# Altium schematic sheet FOTA MicroController.SchDoc: FOTA MicroController
size A4; SheetNumber: 21; SheetTotal: 37
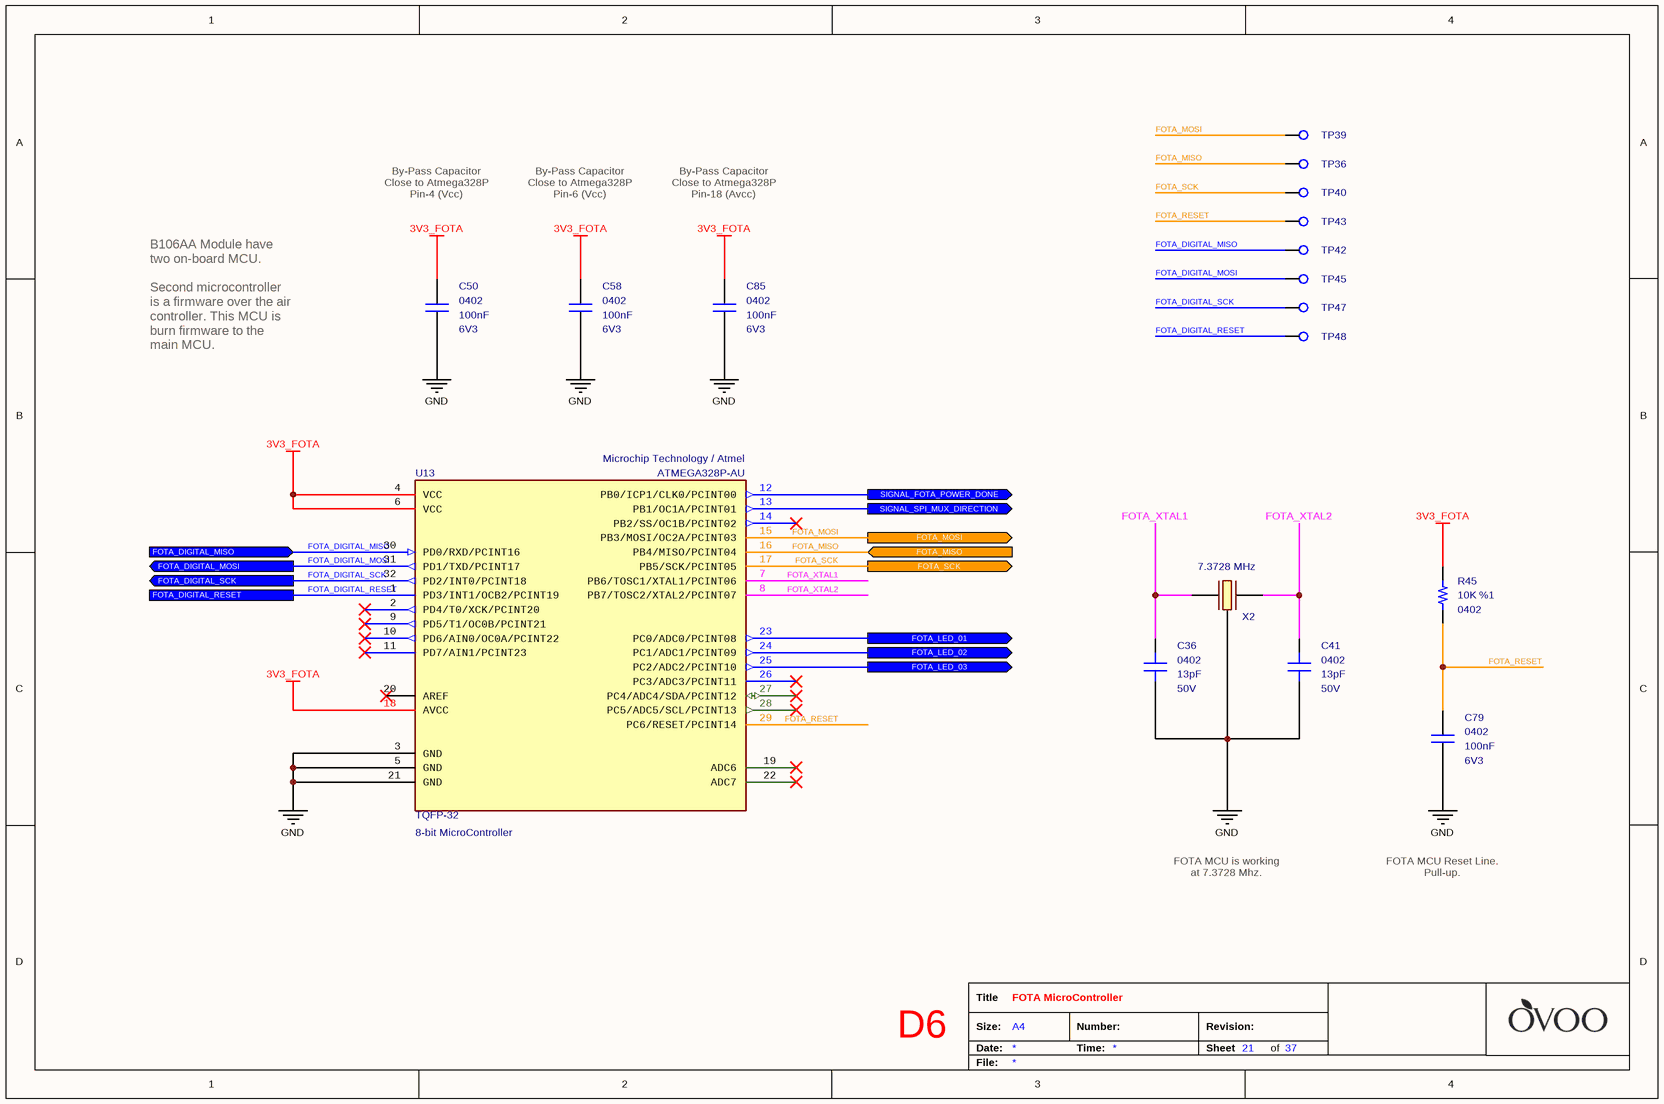
[diagram p0: FOTA MicroController.SchDoc]

## Parts
C36  value 13pF  Voltage: 50V  Case: 0402  [CAPACITOR_0402]  (hidden comment: Multilayer Ceramic Capacitors)
C41  value 13pF  Voltage: 50V  Case: 0402  [CAPACITOR_0402]  (hidden comment: Multilayer Ceramic Capacitors)
C50  value 100nF  Case: 0402  Voltage: 6V3  [CAPACITOR_0402]  (hidden comment: Multilayer Ceramic Capacitor)
C58  value 100nF  Case: 0402  Voltage: 6V3  [CAPACITOR_0402]  (hidden comment: Multilayer Ceramic Capacitor)
C79  value 100nF  Case: 0402  Voltage: 6V3  [CAPACITOR_0402]  (hidden comment: Multilayer Ceramic Capacitor)
C85  value 100nF  Case: 0402  Voltage: 6V3  [CAPACITOR_0402]  (hidden comment: Multilayer Ceramic Capacitor)
R45  value 10K  Tolerance: %1  Case: 0402  [RESISTOR_0402]  (hidden comment: Thick Film Resistor)
TP36  PCB - Test Point  [Test_Pad - Hole]  (value not drawn)  (no BOM)
TP39  PCB - Test Point  [Test_Pad - Hole]  (value not drawn)  (no BOM)
TP40  PCB - Test Point  [Test_Pad - Hole]  (value not drawn)  (no BOM)
TP42  PCB - Test Point  [Test_Pad - Hole]  (value not drawn)  (no BOM)
TP43  PCB - Test Point  [Test_Pad - Hole]  (value not drawn)  (no BOM)
TP45  PCB - Test Point  [Test_Pad - Hole]  (value not drawn)  (no BOM)
TP47  PCB - Test Point  [Test_Pad - Hole]  (value not drawn)  (no BOM)
TP48  PCB - Test Point  [Test_Pad - Hole]  (value not drawn)  (no BOM)
U13  8-bit MicroController  Manufacturer_Part_Number: ATMEGA328P-AU  Manufacturer_Name: Microchip Technology / Atmel  Case: TQFP-32  [TQFP32]
X2  7.3728 MHz  [ABRACON_CRYSTAL]

## Ports
FOTA_DIGITAL_MISO (in), FOTA_DIGITAL_MOSI (out), FOTA_DIGITAL_RESET, FOTA_DIGITAL_SCK (out), FOTA_LED_01 (out), FOTA_LED_02 (out), FOTA_LED_03 (out), FOTA_MISO (in), FOTA_MOSI (out), FOTA_SCK (out), SIGNAL_FOTA_POWER_DONE (out), SIGNAL_SPI_MUX_DIRECTION (out)

## Nets
3V3_FOTA: C50.2 C58.2 C85.2 R45.2 U13.4(VCC) U13.6(VCC) U13.18(AVCC)
GND: C36.1 C41.1 C50.1 C58.1 C79.1 C85.1 U13.3(GND) U13.5(GND) U13.21(GND) X2.2(GND)
FOTA_DIGITAL_MISO: TP42.1 U13.30(PD0/RXD/PCINT16) ; port FOTA_DIGITAL_MISO
FOTA_DIGITAL_MOSI: TP45.1 U13.31(PD1/TXD/PCINT17) ; port FOTA_DIGITAL_MOSI
FOTA_DIGITAL_RESET: TP48.1 U13.1(PD3/INT1/OCB2/PCINT19) ; port FOTA_DIGITAL_RESET
FOTA_DIGITAL_SCK: TP47.1 U13.32(PD2/INT0/PCINT18) ; port FOTA_DIGITAL_SCK
FOTA_LED_01: U13.23(PC0/ADC0/PCINT08) ; port FOTA_LED_01
FOTA_LED_02: U13.24(PC1/ADC1/PCINT09) ; port FOTA_LED_02
FOTA_LED_03: U13.25(PC2/ADC2/PCINT10) ; port FOTA_LED_03
FOTA_MISO: TP36.1 U13.16(PB4/MISO/PCINT04) ; port FOTA_MISO
FOTA_MOSI: TP39.1 U13.15(PB3/MOSI/OC2A/PCINT03) ; port FOTA_MOSI
FOTA_RESET: C79.2 R45.1 TP43.1 U13.29(PC6/RESET/PCINT14)
FOTA_SCK: TP40.1 U13.17(PB5/SCK/PCINT05) ; port FOTA_SCK
FOTA_XTAL1: C36.2 U13.7(PB6/TOSC1/XTAL1/PCINT06) X2.3(OUT/IN)
FOTA_XTAL2: C41.2 U13.8(PB7/TOSC2/XTAL2/PCINT07) X2.1(IN/OUT)
SIGNAL_FOTA_POWER_DONE: U13.12(PB0/ICP1/CLK0/PCINT00) ; port SIGNAL_FOTA_POWER_DONE
SIGNAL_SPI_MUX_DIRECTION: U13.13(PB1/OC1A/PCINT01) ; port SIGNAL_SPI_MUX_DIRECTION

Not connected (* = marked no-connect by the designer): U13 2(PD4/T0/XCK/PCINT20)* 9(PD5/T1/OC0B/PCINT21)* 10(PD6/AIN0/OC0A/PCINT22)* 11(PD7/AIN1/PCINT23)* 14(PB2/SS/OC1B/PCINT02)* 19(ADC6)* 20(AREF)* 22(ADC7)* 26(PC3/ADC3/PCINT11)* 27(PC4/ADC4/SDA/PCINT12)* 28(PC5/ADC5/SCL/PCINT13)*; X2 4(GND)

## Notes on the sheet
- By-Pass Capacitor
  Close to Atmega328P
  Pin-4 (Vcc)
- By-Pass Capacitor
  Close to Atmega328P
  Pin-6 (Vcc)
- By-Pass Capacitor
  Close to Atmega328P
  Pin-18 (Avcc)
- B106AA Module have two on-board MCU.
  Second microcontroller is a firmware over the air controller. This MCU is burn firmware to the main MCU.
- FOTA MCU is working at 7.3728 Mhz.
- FOTA MCU Reset Line. Pull-up.
- D6
- Title
- Size:
- Date:
- A4
- Number:
- Time:
- Revision:
- Sheet
- of
- File:

## Library data of the parts
C36 C41 = Capacitor - 13pF [0402-50V): Capacitor - 13pF [0402] (Ceramic); Manufacturer_Name: Kemet; Manufacturer_Part_Number: CBR04C130F5GAC; Dielectric: C0G; Tolerance: 1%; Height: 0.55mm; Mouser_Part_Number: 80-CBR04C130F5GAC; ROHS: Yes; Weight: 0.65mg; ComponentLink1Description: DataSheet; ComponentLink1URL: http://www.kemet.com/Lists/ProductCatalog/Attachments/490/KEM_C1030_CBR_SMD.pdf; ComponentLink2Description: Mouser; ComponentLink2URL: http://www.mouser.com/Search/ProductDetail.aspx?qs=kSX8PZDGYstn%252bRHasf81FA%3d%3d; Supplier 1: Mouser; Supplier 2: Farnell; Supplier 3: Digi-Key; Supplier Part Number 3: 399-8812-1-ND; Supplier Part Number 2: 2773390; Supplier Part Number 1: 80-CBR04C130F5GAC
C50 C58 C79 C85 = Capacitor - 100nF [0402-6V3]: Capacitor - 100nF [0402-6V3] (Ceramic); Manufacturer_Name: AVX; Manufacturer_Part_Number: 04026D104KAT4A; Dielectric: X5R; Tolerance: %10; Height: 0.25mm; Mouser_Part_Number: 581-04026D104KAT4A; ComponentLink1Description: Mouser; ComponentLink1URL: https://www.mouser.com.tr/ProductDetail/AVX/04026D104KAT4A?qs=sGAEpiMZZMs0AnBnWHyRQPg4iYkCw7IMED%2F4kpqgf7w%3D; ComponentLink2Description: DataSheet; ComponentLink2URL: https://www.mouser.com.tr/datasheet/2/40/cx5r-776519.pdf; ROHS: Yes; Maximum Operating Temperature: +85; Minimum Operating Temperature: -55; Supplier 1: Avnet; Supplier Part Number 1: 04026D104KAT4A
R45 = Resistor - 10K: Thick Film Resistors - SMD 1/16 W 10 Kohms 1%; Manufacturer_Name: Vishay; Manufacturer_Part_Number: CRCW040210K0FKED; Height: 0.4mm; Mouser_Part_Number: 71-CRCW0402-10K-E3; ComponentLink1Description: DataSheet; ComponentLink1URL: https://www.mouser.com.tr/datasheet/2/427/dcrcwe3-1762152.pdf; ComponentLink2Description: Mouser; ComponentLink2URL: https://www.mouser.com.tr/ProductDetail/Vishay-Dale/CRCW040210K0FKED?qs=sGAEpiMZZMu61qfTUdNhG2DpbjADlD3GcalbOv9utCY%3D; Supplier 1: Mouser; Supplier 2: Digi-Key; Supplier Part Number 1: 71-CRCW040210K0FKEDH; Supplier Part Number 2: 541-10.0KYCT-ND
TP36 TP39 TP40 TP42 TP43 TP45 TP47 TP48 = PCB - Test Point: Test Point
U13 = IC - ATMEGA328P: 8-bit Microcontrollers - MCU 32KB In-system Flash 20MHz 1.8V-5.5V; Supply Voltage - Min: 1.8V; Supply Voltage - Max: 5.5V; Height: 1mm; Mouser_Part_Number: 556-ATMEGA328P-AU; ComponentLink1Description: DataSheet; ComponentLink1URL: http://ww1.microchip.com/downloads/en/DeviceDoc/ATmega48A-PA-88A-PA-168A-PA-328-P-DS-DS40002061A.pdf; ROHS: Yes; Minimum Operating Temperature: -40; Maximum Operating Temperature: +85; ComponentLink2Description: Mouser; ComponentLink2URL: https://www.mouser.com.tr/ProductDetail/Microchip-Technology-Atmel/ATMEGA328P-AU?qs=sGAEpiMZZMtVoztFdqDXO3RbBx7FKCmV; ComponentLink3Description: ProductPage; ComponentLink3URL: https://www.microchip.com/wwwproducts/en/ATmega328p; Supplier 1: Avnet; Supplier 2: Mouser; Supplier 3: Arrow; Supplier 4: Digi-Key; Supplier Part Number 1: ATMEGA328P-AU; Supplier Part Number 2: 556-ATMEGA328P-AU; Supplier Part Number 3: ATMEGA328P-AU; Supplier Part Number 4: ATMEGA328P-AU-ND
X2 = Crystal - 7.3728 MHz (Abracon): Crystals 7.3728MHz 18pF -40C +85C; Manufacturer_Part_Number: ABMM2-7.3728MHZ-E2-T; ESR: 150 Ohms; Frequency Stability: 20 ppm; Height: 1.2 mm; Manufacturer_Name: ABRACON; Mouser_Part_Number: 815-ABMM2-7.3-E2-T; Frequency: 7.3728 MHz; Maximum Operating Temperature: +70; Minimum Operating Temperature: -20; ROHS: Yes; Tolerance: 20 ppm; ComponentLink1Description: DataSheet; ComponentLink1URL: https://www.ecsxtal.com/store/pdf/csm-8mr.pdf; ComponentLink2Description: Mouser; ComponentLink2URL: https://www.mouser.com/Search/Refine.aspx?Keyword=520-7.3-18-20BM-JENT; Supplier 1: Mouser; Supplier 2: Arrow; Supplier Part Number 2: ABMM2-7.3728MHZ-E2-T; Supplier Part Number 1: 815-ABMM2-7.3-E2-T